# EasyEDA schematic SCH_MONITORING-BANJIR_2024-11-29.json
TITLE: MONITORING BANJIR DAN HUJAN\nBERBASIS LORAWAN; REV: 1.0; Date: 2024-10-29; Sheet: 1/1; Drawn By: rizki.chandra.1905366; Company: POLTEKAD
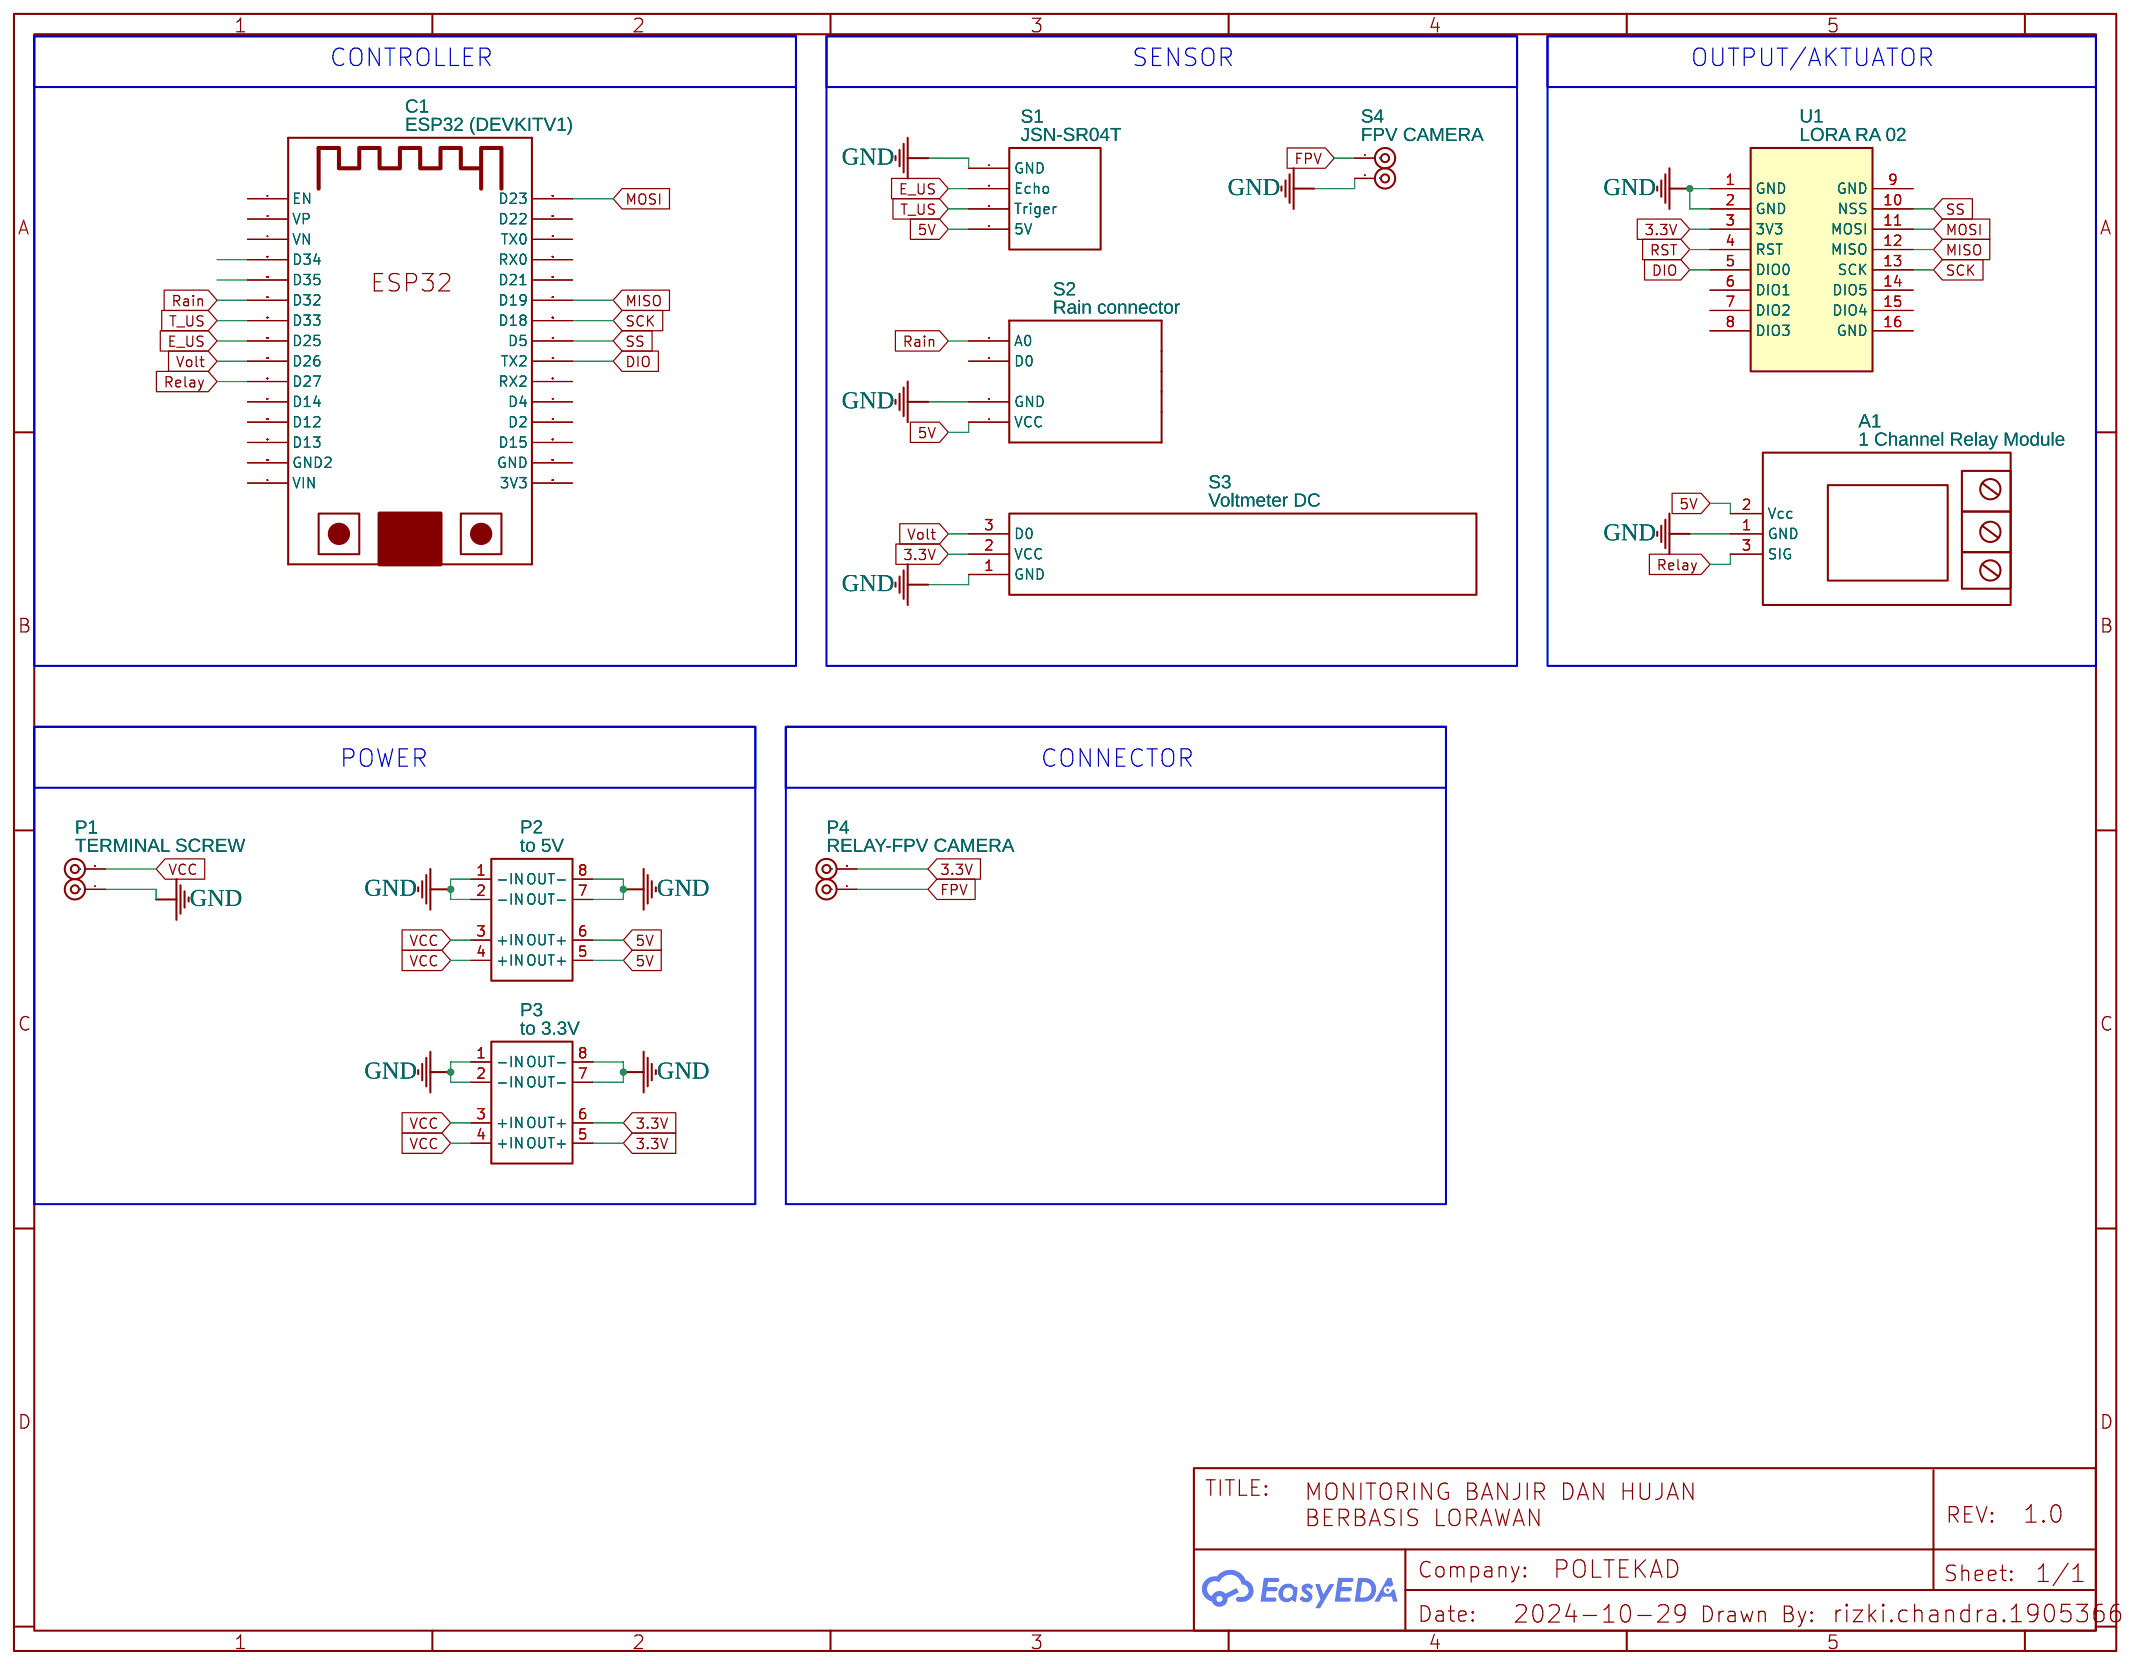
[diagram p0: schematic sheet]

## Parts
A1  1 Channel Relay Module  [RELAY MODULE 1 RELAYS]
C1  ESP32 (DEVKITV1)  [ESP32-DEVKITV1_ESP32-DEVKITV1]
P1  TERMINAL SCREW  [PINHEADER1X2]
P2  to 5V  [MP1584EN]
P3  to 3.3V  [MP1584EN]
P4  RELAY-FPV CAMERA  [PINHEADER1X2]
S1  JSN-SR04T  [JSN-SR04T]
S2  Rain connector  [4 PIN RAINDROPS HEADER]
S3  Voltmeter DC  [TCRT5000 LINE TRACKING MODULE]
S4  FPV CAMERA  [PINHEADER1X2]
U1  LORA RA 02  [RA-02_MODULE]

## Library data of the parts
A1 = 1 Channel Relay Module: Manufacturer Part: 1-Channel 5V Relay Module w/ Opto-isolator; Supplier Part: SKU: 223429; link: http://www.volumerate.com/product/1-channel-5v-relay-module-w-opto-isolator-red-blue-223429; Contributor: maman12
C1 = ESP32-DEVKIT-V1-30PIN: Contributor: vishu24.12
P1 P4 S4 = HEADER-MALE-2.54-1X2-2P: Supplier Part: undefined; Contributor: Piero Cimule
P2 P3 = MP1584EN-KZ: Contributor: khimji
S1 = JSN-SR04T: Contributor: gilang.muhammaddgg
S2 = Rain connector: sourceId: wMGAR9rlD; Package Display: No
S3 = TCRT5000 LINE SENSOR MODULE: Manufacturer Part: Line_sensor; Contributor: lecui; Package Display: No
U1 = LORA RA 02: Manufacturer: AiThinker; Manufacturer Part: Ra-02; Supplier: LCSC; Supplier Part: Ra-02; Contributor: tamvo

## Nets
3.3V: P3.5(OUT+) P3.6(OUT+) P4.2 S3.2(VCC) U1.3(3V3)
5V: A1.2(Vcc) P2.5(OUT+) P2.6(OUT+) S1.1(5V) S2.4(VCC)
GND: A1.1(GND) P1.1 P2.1(-IN) P2.2(-IN) P2.7(OUT-) P2.8(OUT-) P3.1(-IN) P3.2(-IN) P3.7(OUT-) P3.8(OUT-) S1.4(GND) S2.3(GND) S3.1(GND) S4.2 U1.1(GND) U1.2(GND)
VCC: P1.2 P2.3(+IN) P2.4(+IN) P3.3(+IN) P3.4(+IN)
DIO: C1.TX2 U1.5(DIO0)
E_US: C1.D25 S1.3(Echo)
FPV: P4.1 S4.1
MISO: C1.D19 U1.12(MISO)
MOSI: C1.D23 U1.11(MOSI)
Rain: C1.D32 S2.1(A0)
Relay: A1.3(SIG) C1.D27
RST: U1.4(RST)
SCK: C1.D18 U1.13(SCK)
SS: C1.D5 U1.10(NSS)
T_US: C1.D33 S1.2(Triger)
Volt: C1.D26 S3.3(D0)

Not connected (* = marked no-connect by the designer): C1 3V3 D2 D4 D12 D13 D14 D15 D21 D22 D34 D35 EN GND GND2 RX0 RX2 TX0 VIN VN VP; S2 2(D0); U1 6(DIO1) 7(DIO2) 8(DIO3) 9(GND) 14(DIO5) 15(DIO4) 16(GND)

## Notes on the sheet
- CONTROLLER
- SENSOR
- OUTPUT/AKTUATOR
- POWER
- CONNECTOR
